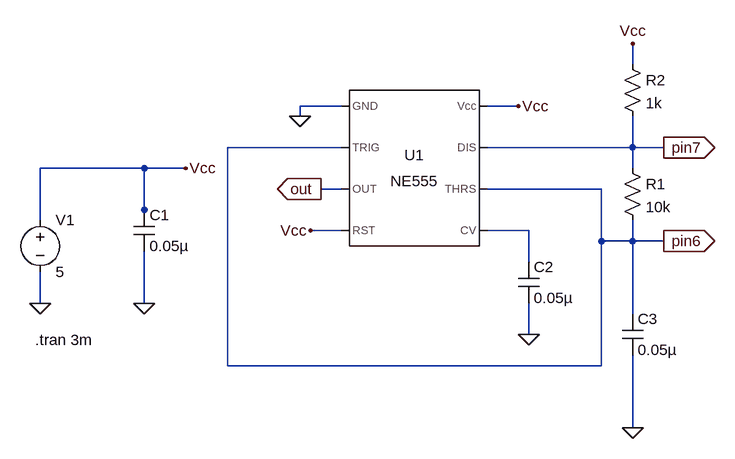
[diagram p0: schematic Astable_Multivibrator.asc]
Astable_Multivibrator.asc, the LTspice schematic file:
Version 4
SHEET 1 1792 680
WIRE 848 -112 848 -144
WIRE 400 -48 336 -48
WIRE 672 -48 624 -48
WIRE 336 -32 336 -48
WIRE 400 16 224 16
WIRE 848 16 848 -32
WIRE 848 16 624 16
WIRE 896 16 848 16
WIRE 96 48 -64 48
WIRE 160 48 96 48
WIRE 848 48 848 16
WIRE 400 80 368 80
WIRE 800 80 624 80
WIRE 96 112 96 48
WIRE -64 128 -64 48
WIRE 96 128 96 112
WIRE 400 144 352 144
WIRE 688 144 624 144
WIRE 800 160 800 80
WIRE 848 160 848 128
WIRE 848 160 800 160
WIRE 896 160 848 160
WIRE 688 192 688 144
WIRE -64 256 -64 208
WIRE 96 256 96 176
WIRE 848 272 848 160
WIRE 688 304 688 256
WIRE 224 352 224 16
WIRE 800 352 800 160
WIRE 800 352 224 352
WIRE 848 448 848 336
FLAG -64 256 0
FLAG 96 256 0
FLAG 160 48 Vcc
FLAG 336 -32 0
FLAG 368 80 out
IOPIN 368 80 Out
FLAG 352 144 Vcc
FLAG 672 -48 Vcc
FLAG 688 304 0
FLAG 896 16 pin7
IOPIN 896 16 Out
FLAG 848 448 0
FLAG 896 160 pin6
IOPIN 896 160 Out
FLAG 848 -144 Vcc
SYMBOL voltage -64 112 R0
WINDOW 123 0 0 Left 0
WINDOW 39 0 0 Left 0
SYMATTR InstName V1
SYMATTR Value 5
SYMBOL cap 80 112 R0
SYMATTR InstName C1
SYMATTR Value 0.05µ
SYMBOL Misc\\NE555 512 48 R0
SYMATTR InstName U1
SYMBOL cap 672 192 R0
SYMATTR InstName C2
SYMATTR Value 0.05µ
SYMBOL cap 832 272 R0
SYMATTR InstName C3
SYMATTR Value 0.05µ
SYMBOL res 832 32 R0
SYMATTR InstName R1
SYMATTR Value 10k
SYMBOL res 832 -128 R0
SYMATTR InstName R2
SYMATTR Value 1k
TEXT -72 312 Left 2 !.tran 3m

The netlist it stands for:
* Astable_Multivibrator.asc
V1 Vcc 0 5
C1 Vcc 0 0.05µ
XU1 0 pin6 out Vcc N001 pin6 pin7 Vcc NE555  ; pins GND TRIG OUT RST CV THRS DIS Vcc
C2 N001 0 0.05µ
C3 pin6 0 0.05µ
R1 pin7 pin6 10k
R2 Vcc pin7 1k
.tran 3m
.lib NE555.sub
.backanno
.end